# EAGLE design main (EAGLE 9.6.2)
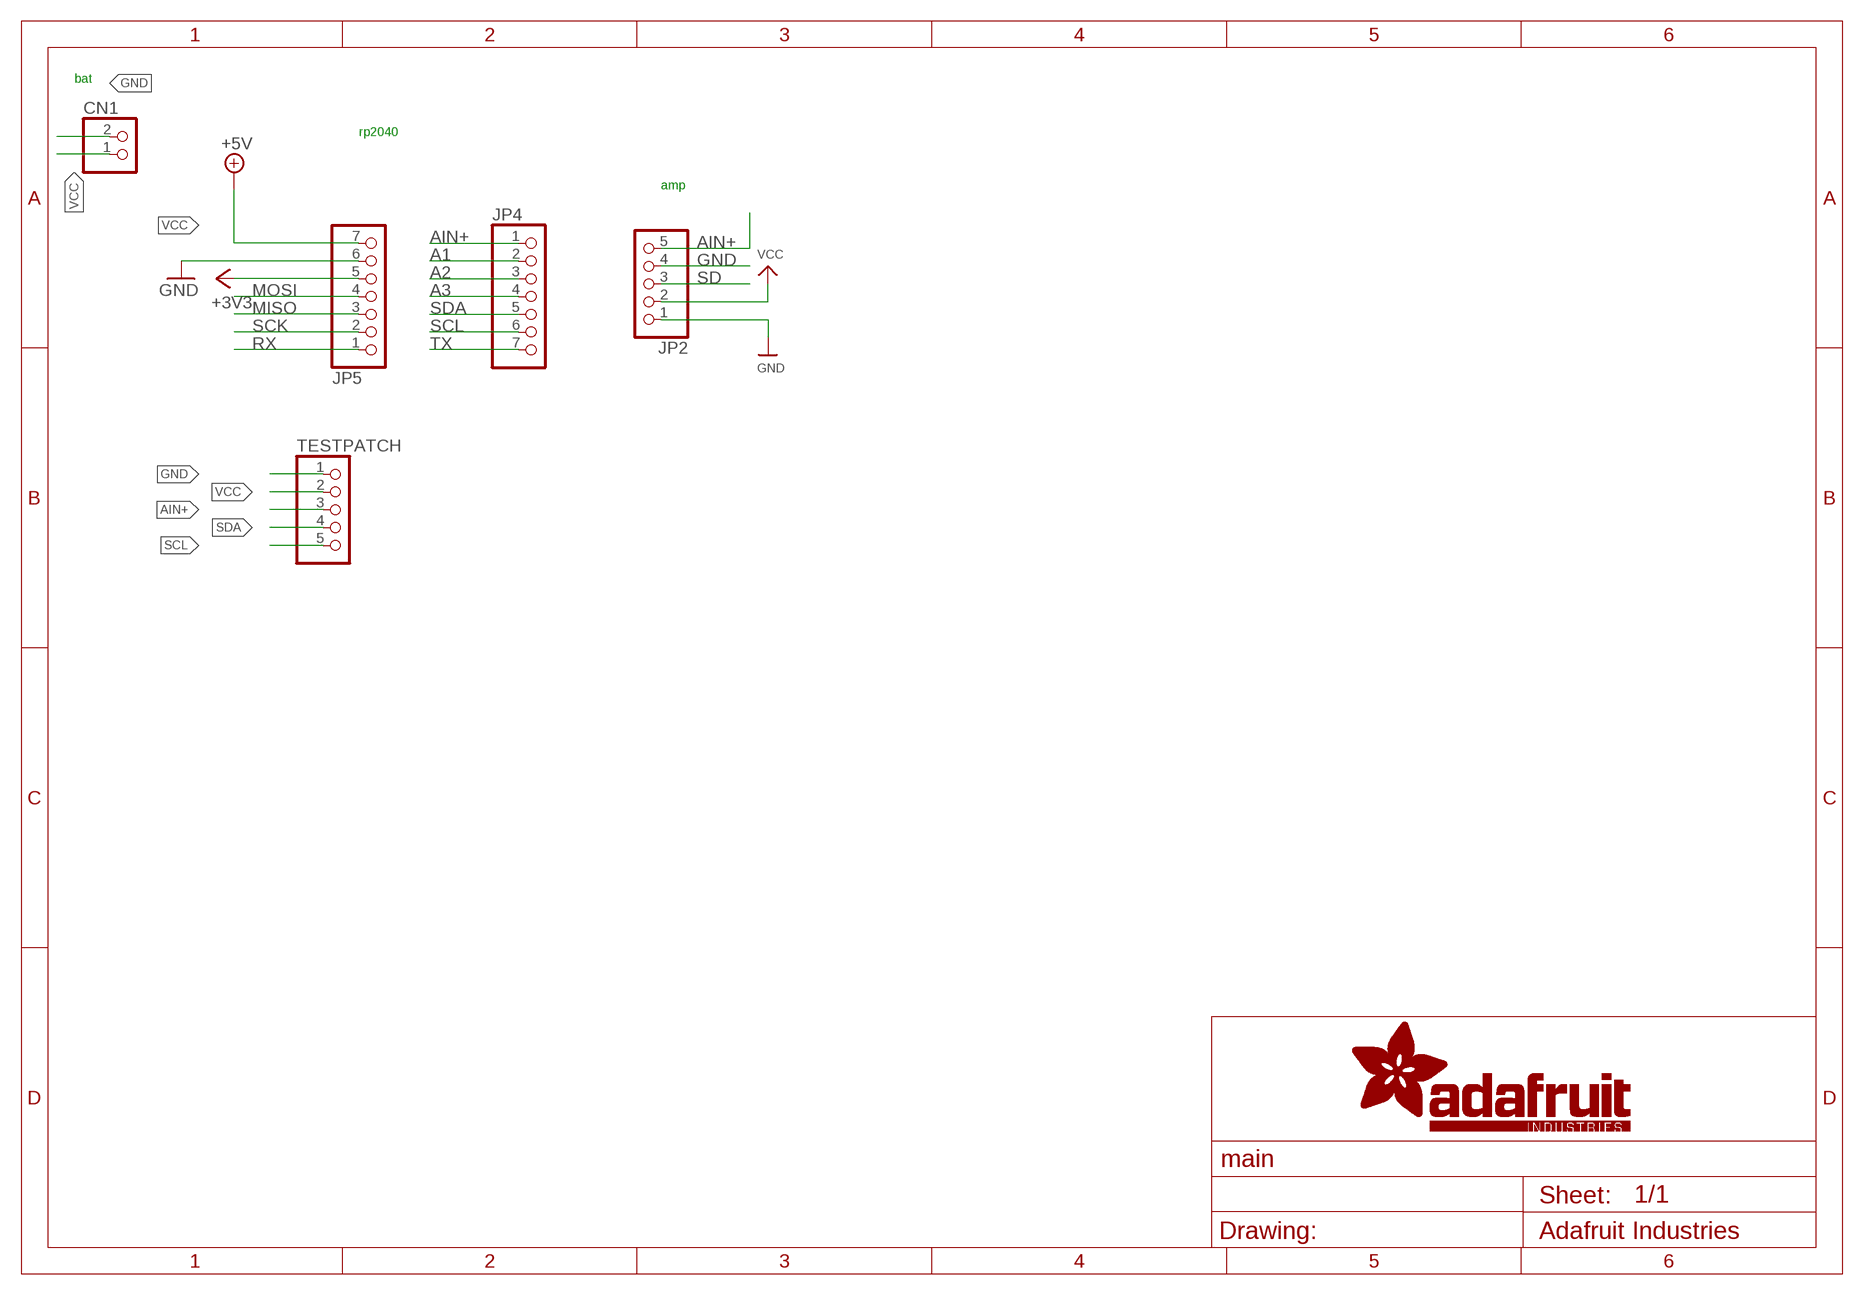
[diagram p0: schematic, sheet 1]

## Parts
CN1  JST_2PIN-THM  [JST-PH-2-THM]
JP2  HEADER-1X570MIL  [1X05_ROUND_70]
JP4  HEADER-1X7  [1X07_OVAL]
JP5  HEADER-1X7  [1X07_OVAL]
TESTPATCH  PINHD-1X5  [1X05]

## Nets
+3V3: JP5.5
A1: JP4.2
A2: JP4.3
A3: JP4.4
AIN+: JP2.5 JP4.1 TESTPATCH.3
GND: CN1.2 JP2.1 JP2.4 JP5.6 TESTPATCH.1
MISO: JP5.3
MOSI: JP5.4
RX: JP5.1
SCK: JP5.2
SCL: JP4.6 TESTPATCH.5
SD: JP2.3
SDA: JP4.5 TESTPATCH.4
TX: JP4.7
VCC: CN1.1 JP2.2 JP5.7 TESTPATCH.2 ; supply symbol labelled +5V

## Notes on the sheet
- bat
- rp2040
- amp

## Library data of the parts
CN1 = adafruit:JST_2PIN: JST 2-Pin Connectors of various flavors SMT-RA (S2B-PH-SM4) 4UConnector #17311 SMT (B2B-PH-SM4) THM-RA (S2B-PH) THM (B2B-PH)
JP2 = microbuilder:HEADER-1X5: PIN HEADER
JP4 JP5 = microbuilder:HEADER-1X7: PIN HEADER
TESTPATCH = pinhead:PINHD-1X5: PIN HEADER

## Net classes
1 power: width 0.305 mm
2 lowpower: width 0.254 mm, drill 0.381 mm

## Board
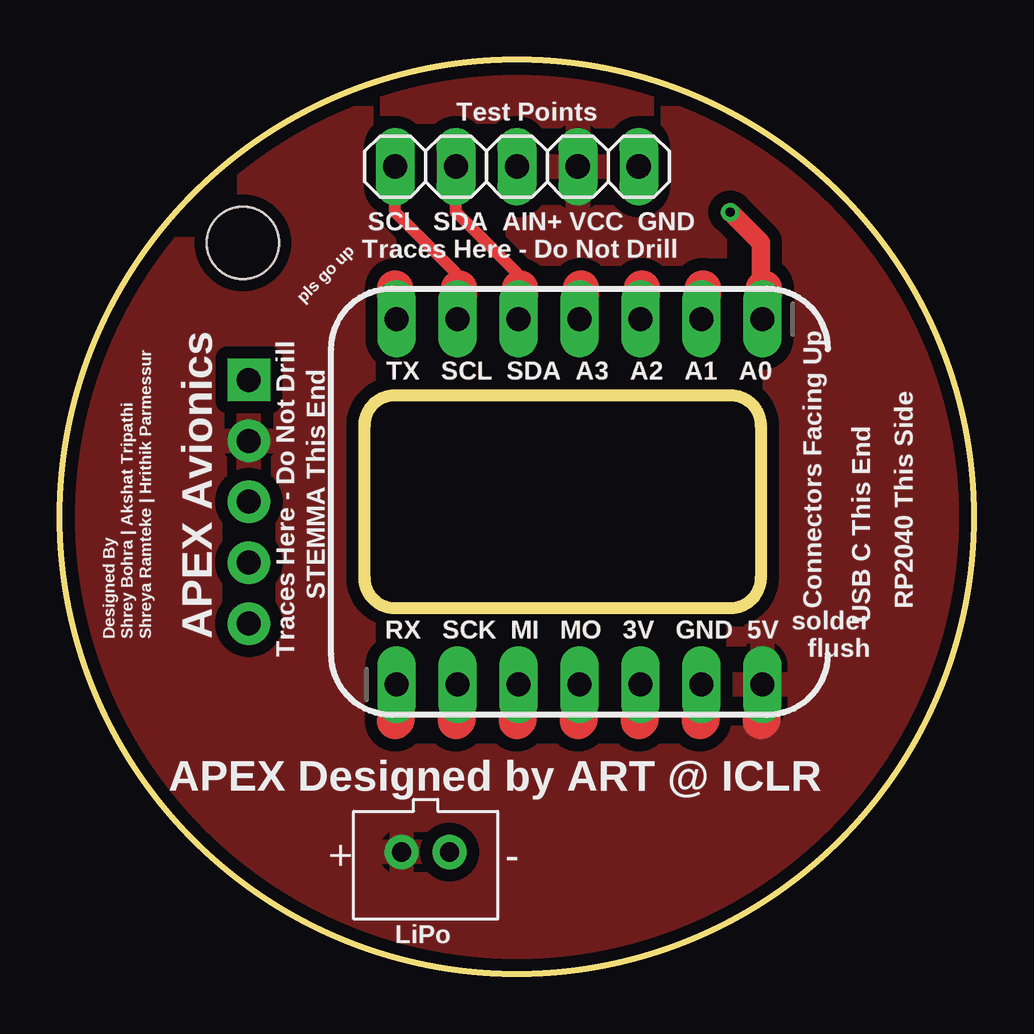
[diagram p1: board, top side]
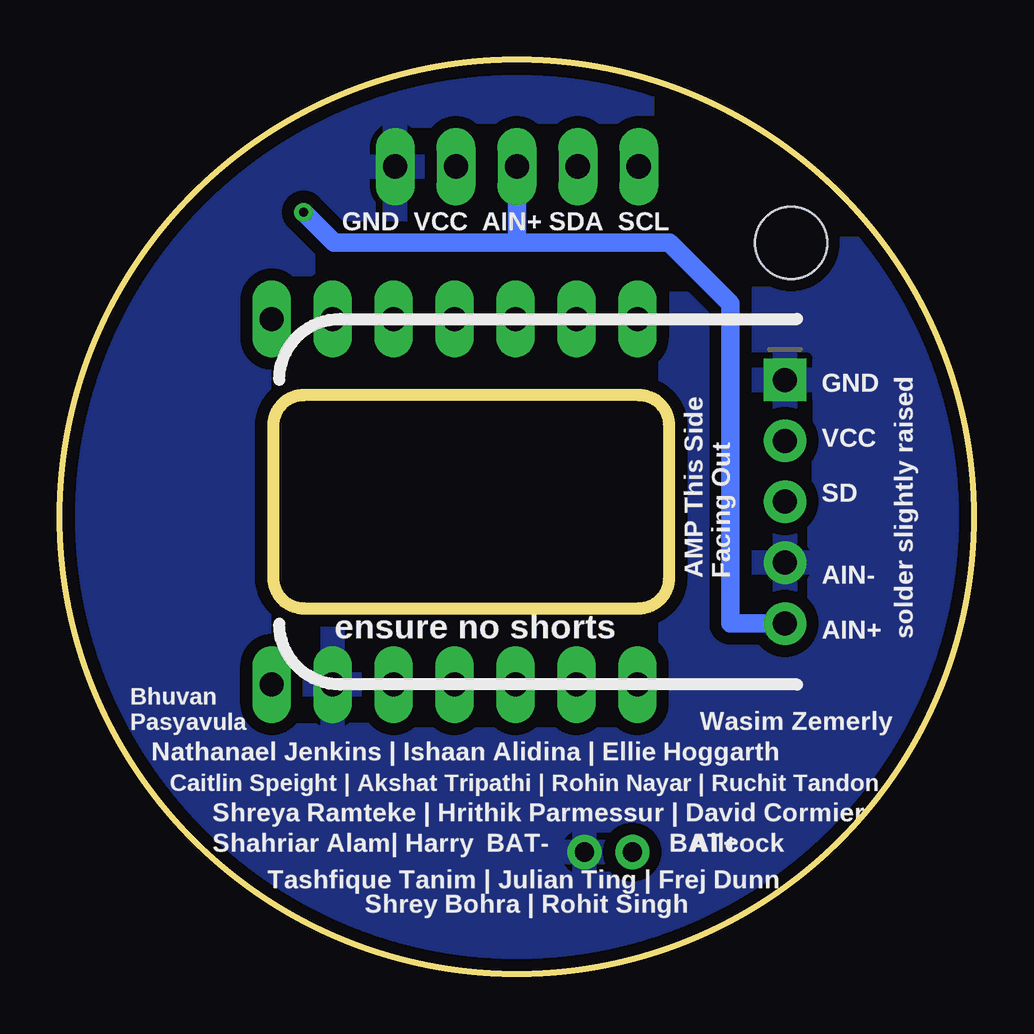
[diagram p2: board, bottom side, seen from below]

Size 38.1 x 38.1 mm. Coordinates in mm from the lower left corner, seen from the top.
Outline: 12.7,22.86 arc-90 13.97,24.13 27.94,24.13 arc-90 29.21,22.86 29.21,16.51 arc-90 27.94,15.24 13.97,15.24 arc-90 12.7,16.51 12.7,22.86
Outline: circle at 19.05,19.05 radius 19.05
Copper layers (1*16): Top 0.035mm / dielectric 1.5mm / Bottom 0.035mm
Design rules "aisler_2_layer_simple *": minimum track width 0.1mm, minimum drill 0.3mm, track to track 0.1mm, track to pad 0.1mm, pad to pad 0.1mm, via to via 0.1mm, smd to smd 0.1mm, copper to edge 0.3mm, drill to drill 0.25mm, minimum pad ring 0.3mm, minimum via ring 0.2mm, stop-mask expansion 0mil, vias tented up to drill 0mil, thermal gap 10mil
Holes 3 mm at 7.62,30.48

### Footprints (pad centres in the part's own frame; a part is rotated, then mirrored left to right if it is on the bottom)
JST-PH-2-THM = drill 0.8 pad 1.422: 1 1,0; 2 -1,0
1X05_ROUND_70 = drill 1 pad 1.778 square: 1 -5.08,0 | drill 1 pad 1.778: 2 -2.54,0; 3 0,0; 4 2.54,0; 5 5.08,0
1X07_OVAL = drill 1 long: 1 -7.62,0; 2 -5.08,0; 3 -2.54,0; 4 0,0; 5 2.54,0; 6 5.08,0; 7 7.62,0
1X05 = drill 1.016 long: 1 -5.08,0; 2 -2.54,0; 3 0,0; 4 2.54,0; 5 5.08,0

### Placement (x,y rotation side)
CN1  15.24,5.08 180 top
JP2  7.87,19.69 270 bottom
JP4  21.65,27.3 180 top
JP5  21.65,12.07 0 top
TESTPATCH  19.05,33.66 180 top

### Tracks (layer width: path | path; a pad name or v marks a point on that pad's centre or on a via)
+3V3
  Top 1.524: JP5.5 24.19,10.61 24.13,10.54
AIN+  (via drill 0.38)
  Top 0.762: JP4.1 29.21,27.37 29.21,30.48 v27.94,31.75
  Bottom 0.762: v27.94,31.75 26.67,30.48 19.05,30.48 | 19.05,30.48 12.7,30.48 10.16,27.94 10.16,14.61 JP2.5 | TESTPATCH.3 19.05,30.48
GND
  Top 1.524: JP5.6 26.73,10.61 26.67,10.54
  pour Bottom (isolate 0.508): -3.81,40.64 41.91,40.64 41.91,-3.81 -3.81,-3.81
MISO
  Top 1.524: JP5.3 19.11,10.61 19.05,10.54
MOSI
  Top 1.524: JP5.4 21.65,10.61 21.59,10.54
N$1
  Top 1.524: 13.97,28.32 13.97,28.58
N$2
  Top 1.524: 16.64,28.32 16.64,28.58
N$3
  Top 1.524: 19.18,28.32 19.18,28.58
N$4
  Top 1.524: 21.72,28.32 21.72,28.58
N$5
  Top 1.524: 24.26,28.32 24.26,28.58
N$6
  Top 1.524: 26.8,28.32 26.8,28.58
N$7
  Top 1.524: 29.34,28.32 29.34,28.58
RX
  Top 1.524: JP5.1 14.03,10.61 13.97,10.54
SCK
  Top 1.524: JP5.2 16.57,10.61 16.51,10.54
SCL
  Top 0.508: JP4.6 16.51,27.37 16.51,29.21 13.97,31.75 TESTPATCH.5
SDA
  Top 0.508: JP4.5 19.05,27.37 19.05,29.21 16.51,31.75 TESTPATCH.4
VCC
  Top 1.524: JP5.7 29.27,10.61 29.21,10.54
  pour Top (isolate 0.508): -3.81,40.64 41.91,40.64 41.91,-3.81 -3.81,-3.81

### Text on the board
tNames: Test Points | SCL SDA AIN+ VCC GND | Traces Here - Do Not Drill | pls go up | TX SCL SDA A3 A2 A1 A0 | USB C This End | STEMMA This End | RX SCK MI MO 3V GND 5V | Connectors Facing Up | solder / flush | RP2040 This Side | Designed By / Shrey Bohra | Akshat Tripathi / Shreya Ramteke | Hrithik Parmessur | APEX Avionics | Traces Here - Do Not Drill | APEX Designed by ART @ ICLR | LiPo
bNames: GND VCC AIN+ SDA SCL | AMP This Side / Facing Out | solder slightly raised | GND / / VCC / / SD / / / AIN- / / AIN+ | ensure no shorts | Wasim Zemerly | Bhuvan / Pasyavula | Nathanael Jenkins | Ishaan Alidina | Ellie Hoggarth | Caitlin Speight | Akshat Tripathi | Rohin Nayar | Ruchit Tandon | Shreya Ramteke | Hrithik Parmessur | David Cormier | BAT+ | BAT- | Shahriar Alam| Harry Allcock | Tashfique Tanim | Julian Ting | Frej Dunn | Shrey Bohra | Rohit Singh